# EAGLE design munia-n64 (EAGLE 9.1.0)

## Sheet 1 of 4: MCU
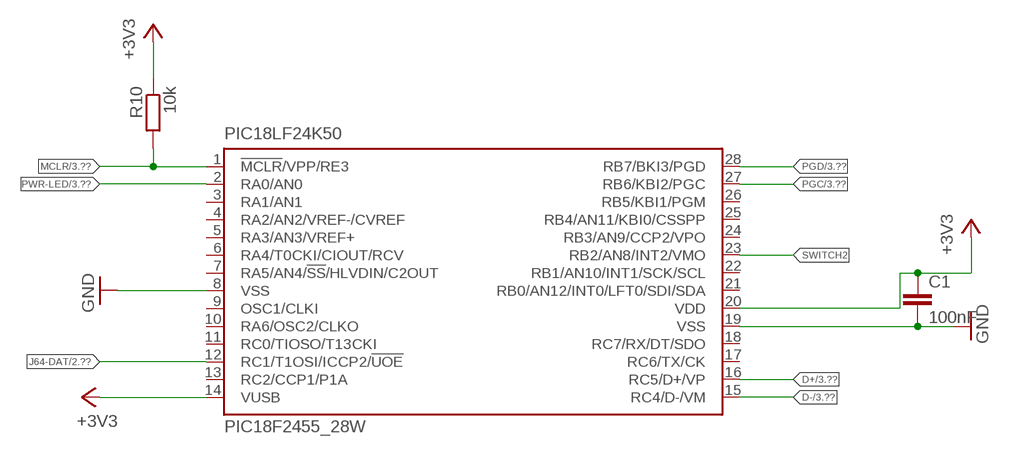
[diagram p0: schematic, sheet 1]

### Parts
C1  100nF  C-EUC0603  [C0603]
PIC18LF24K50  PIC18F2455_28W  [SO28W]
R10  10k  R-EU_R0603  [R0603]

### Nets
+3V3: C1.1 PIC18LF24K50.14(VUSB) PIC18LF24K50.20(VDD) R10.1 ; also sheet 2,3,4
D+: PIC18LF24K50.16(RC5/D+/VP) ; also sheet 3
D-: PIC18LF24K50.15(RC4/D-/VM) ; also sheet 3
GND: C1.2 PIC18LF24K50.8(VSS) PIC18LF24K50.19(VSS) ; also sheet 2,3,4
J64-DAT: PIC18LF24K50.12(RC1/T1OSI/ICCP2/!UOE) ; also sheet 2,3
MCLR: PIC18LF24K50.1(!MCLR!/VPP/RE3) R10.2 ; also sheet 3
PGC: PIC18LF24K50.27(RB6/KBI2/PGC) ; also sheet 3
PGD: PIC18LF24K50.28(RB7/BKI3/PGD) ; also sheet 3
PWR-LED: PIC18LF24K50.2(RA0/AN0) ; also sheet 3
SWITCH2: PIC18LF24K50.23(RB2/AN8/INT2/VMO)
Unconnected: PIC18LF24K50.3(RA1/AN1) PIC18LF24K50.4(RA2/AN2/VREF-/CVREF) PIC18LF24K50.5(RA3/AN3/VREF+) PIC18LF24K50.6(RA4/T0CKI/CIOUT/RCV) PIC18LF24K50.7(RA5/AN4/!SS!/HLVDIN/C2OUT) PIC18LF24K50.9(OSC1/CLKI) PIC18LF24K50.10(RA6/OSC2/CLKO) PIC18LF24K50.11(RC0/TIOSO/T13CKI) PIC18LF24K50.13(RC2/CCP1/P1A) PIC18LF24K50.17(RC6/TX/CK) PIC18LF24K50.18(RC7/RX/DT/SDO) PIC18LF24K50.21(RB0/AN12/INT0/LFT0/SDI/SDA) PIC18LF24K50.22(RB1/AN10/INT1/SCK/SCL) PIC18LF24K50.24(RB3/AN9/CCP2/VPO) PIC18LF24K50.25(RB4/AN11/KBI0/CSSPP) PIC18LF24K50.26(RB5/KBI1/PGM)

## Sheet 2 of 4: SIGNALS
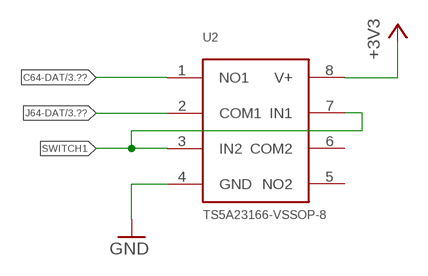
[diagram p1: schematic, sheet 2]

### Parts
U2  TS5A23166-VSSOP-8  [SOT765]

### Nets
+3V3: U2.8(V+) ; also sheet 1,3,4
C64-DAT: U2.1(NO1) ; also sheet 3
GND: U2.4(GND) ; also sheet 1,3,4
J64-DAT: U2.2(COM1) ; also sheet 1,3
SWITCH1: U2.3(IN2) U2.7(IN1)
Unconnected: U2.5(NO2) U2.6(COM2)

## Sheet 3 of 4: CONNECTORS
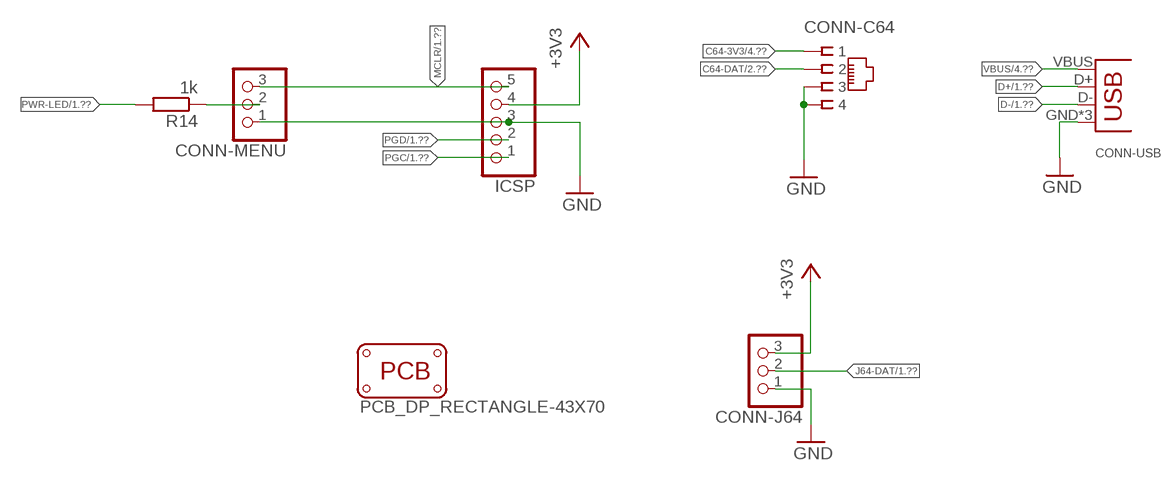
[diagram p2: schematic, sheet 3]

### Parts
CONN-C64  RJ11-6P4C  [RJ11-4C]
CONN-J64  PINHD-1X3  [1X03]
CONN-MENU  PINHD-1X3  [1X03]
CONN-USB  USB-B-NIELS  [USB-B-H]
ICSP  PINHD-1X5  [1X05]
PCB1  PCB_DP_RECTANGLE-43X70  [DP7043_V1]
R14  1k  R-EU_R0603  [R0603]

### Nets
+3V3: CONN-J64.3 ICSP.4 ; also sheet 1,2,4
C64-3V3: CONN-C64.1 ; also sheet 4
C64-DAT: CONN-C64.2 ; also sheet 2
D+: CONN-USB.D+ ; also sheet 1
D-: CONN-USB.D- ; also sheet 1
GND: CONN-C64.3 CONN-C64.4 CONN-J64.1 CONN-MENU.1 CONN-USB.GND CONN-USB.GND@1(GND) CONN-USB.GND@2(GND) ICSP.3 ; also sheet 1,2,4
J64-DAT: CONN-J64.2 ; also sheet 1,2
MCLR: CONN-MENU.3 ICSP.5 ; also sheet 1
N$1: CONN-MENU.2 R14.1
PGC: ICSP.1 ; also sheet 1
PGD: ICSP.2 ; also sheet 1
PWR-LED: R14.2 ; also sheet 1
VBUS: CONN-USB.VBUS ; also sheet 4

## Sheet 4 of 4: POWER
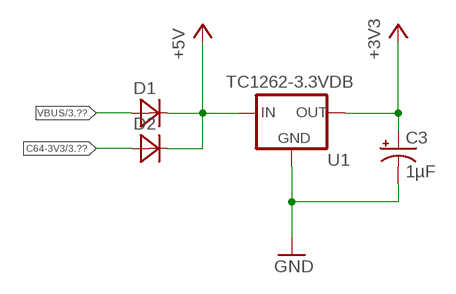
[diagram p3: schematic, sheet 4]

### Parts
C3  1µF  TANT-CAP1206  [EIA3216]
D1  MBR120VLSFT1G  [SOD123]
D2  MBR120VLSFT1G  [SOD123]
U1  TC1262-3.3VDB  [SOT230P700X180-4N]

### Nets
+3V3: C3.A(+) U1.3(OUT) ; also sheet 1,2,3
+5V: D1.1(C) D2.1(C) U1.1(IN)
C64-3V3: D2.2(A) ; also sheet 3
GND: C3.C(-) U1.2(GND) U1.4(GND) ; also sheet 1,2,3
VBUS: D1.2(A) ; also sheet 3

## Library data of the parts
C1 = resistor:C-EU: CAPACITOR, European symbol
C3 = Spark:TANT-CAP: Tantalum SMT
CONN-C64 = frank:RJ11-6P4C
CONN-J64 CONN-MENU = pinhead:PINHD-1X3: PIN HEADER
CONN-USB = frank:USB: USB Connectors
D1 D2 = frank:MBR120VLSFT1G: DIODE, SCHOTTKY, 1A, 20V, SOD-123FL
ICSP = pinhead:PINHD-1X5: PIN HEADER
PCB1 = dp_pcb:PCB_DP_RECTANGLE: Dangerous Prototypes Standard Rectangular PCB sizes
PIC18LF24K50 = microchip:PIC18F2*_28: USB Microcontrollers with nanoWatt Technology High-Performance, Enhanced Flash, 28/40/44-Pin, Source: http://ww1.microchip.com/downloads/en/devicedoc/39632c.pdf; MF: MICROCHIP; MPN: PIC18F2455-I/SO; OC_FARNELL: 1579598; OC_NEWARK: 64J3768
R10 R14 = resistor:R-EU_: RESISTOR, European symbol
U1 = frank:TC1262-3.3VDB: IC, 500mA Fixed Output CMOS LDO,3.3V,SOT-223, 3-lead; MPN: TC1262-3.3VDB; OC_FARNELL: 1852183; OC_NEWARK: 53R0370; PACKAGE: SOT-223-3; SUPPLIER: Microchip
U2 = frank:TS5A23166

## Net classes
0 default: width 0.152 mm, drill 0.25 mm, clearance 0.152 mm

## Board
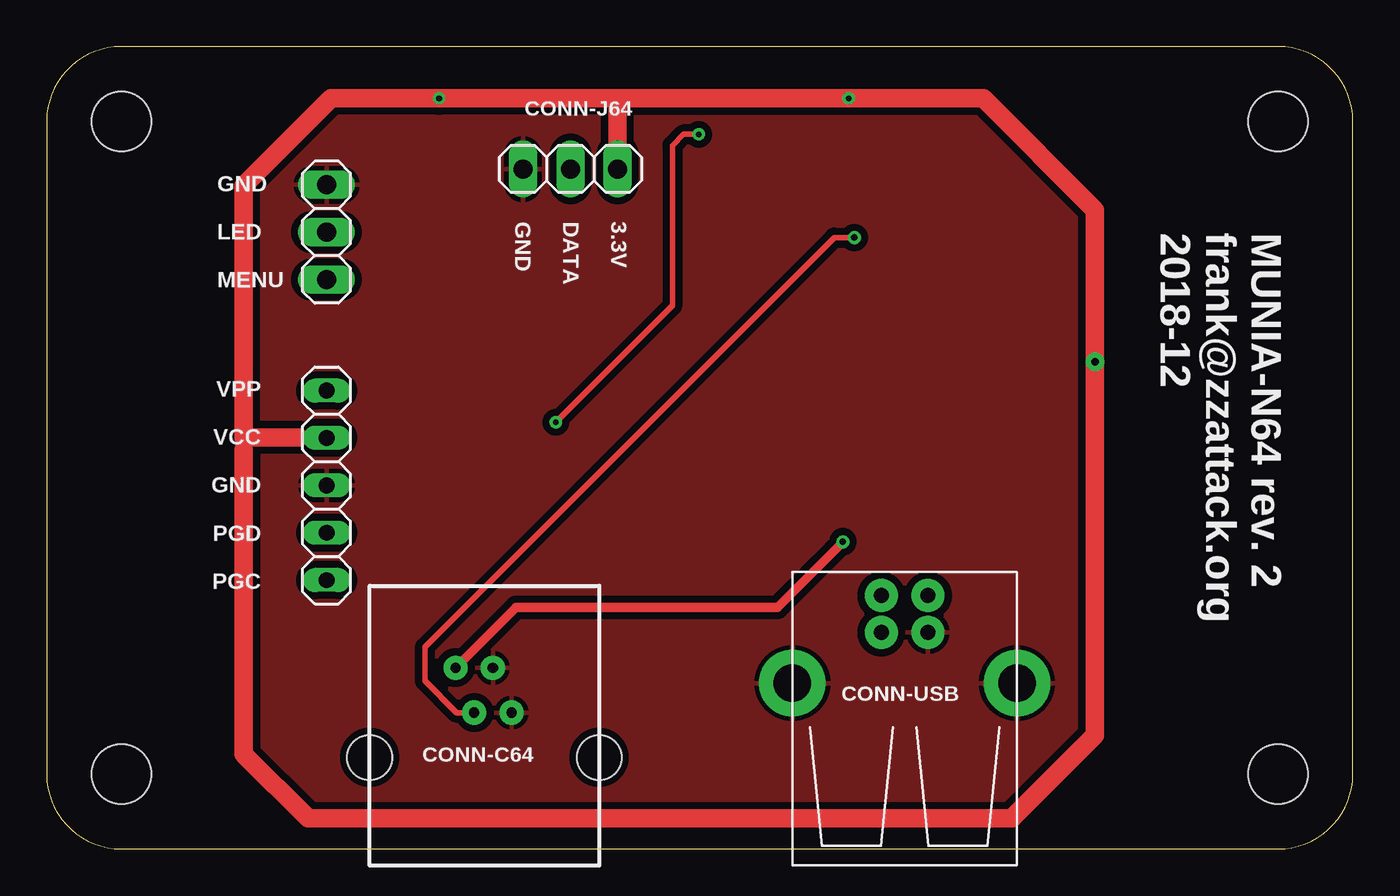
[diagram p4: board, top side]
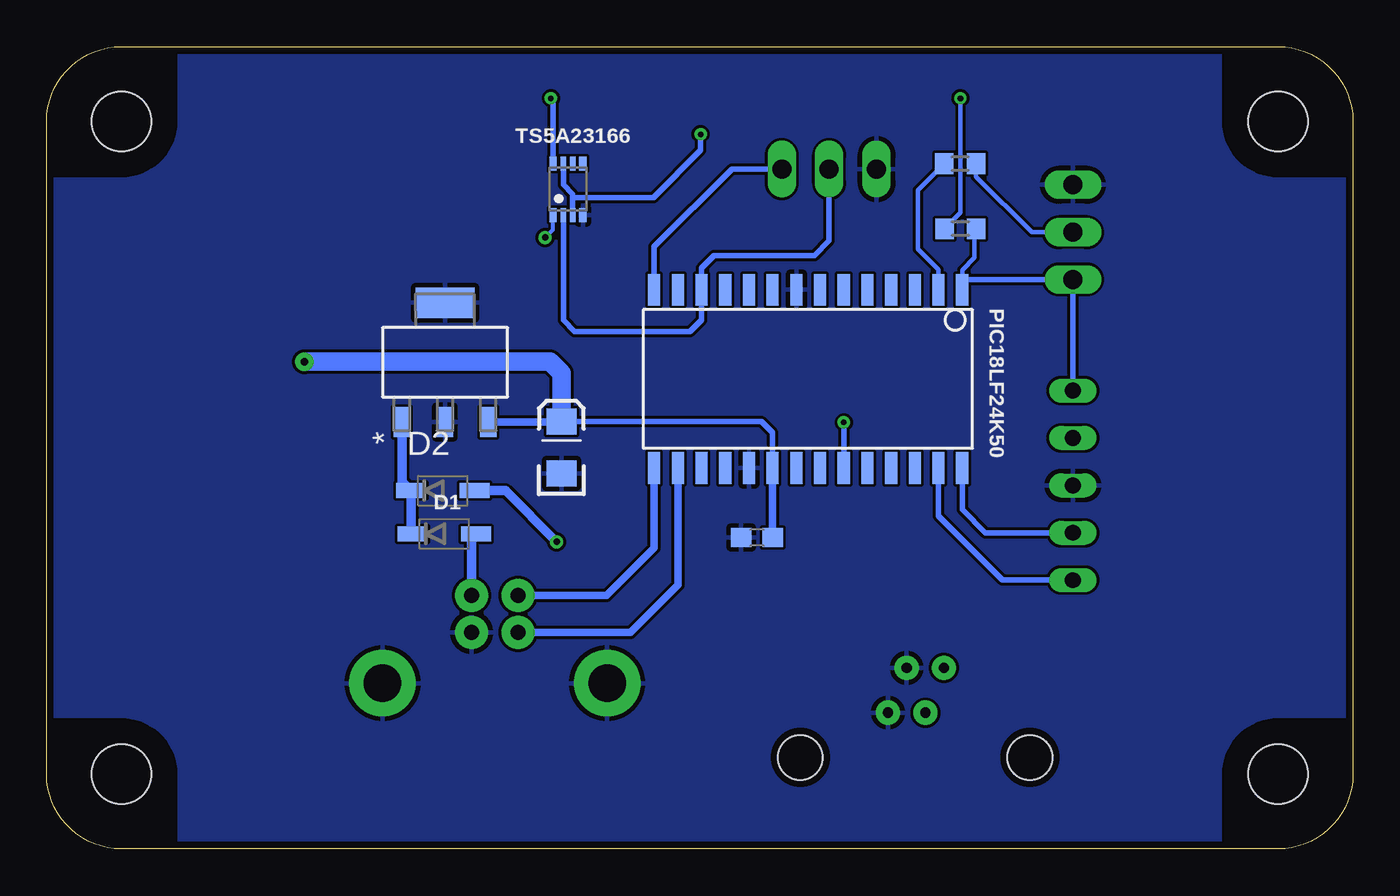
[diagram p5: board, bottom side, seen from below]

Size 70 x 43 mm. Coordinates in mm from the lower left corner, seen from the top.
Copper layers (1*16): Top 0.0356mm / dielectric 1.5011mm / Bottom 0.0356mm
Design rules "pcbway 6mil 0.3mm drills *": minimum track width 6mil, minimum drill 0.3mm, track to track 6mil, track to pad 6mil, pad to pad 6mil, via to via 6mil, smd to smd 6mil, copper to edge 15mil, drill to drill 6mil, minimum pad ring 7mil, minimum via ring 7mil, stop-mask expansion 4mil, vias tented up to drill 999mil, thermal gap 10mil

### Footprints (pad centres in the part's own frame; a part is rotated, then mirrored left to right if it is on the bottom)
C0603 = smd 1.1 x 1: 1 -0.85,0; 2 0.85,0
EIA3216 = smd 1.4 x 1.6: A 1.4,0; C -1.4,0
RJ11-4C = drill 0.55 pad 1.3: 1 4.6,10.6; 2 5.6,8.2; 3 6.6,10.6; 4 7.6,8.2 | hole 2.4: 0,5.8; 12.3,5.8
1X03 = drill 1.016 long: 1 -2.54,0; 2 0,0; 3 2.54,0
USB-B-H = drill 0.8 pad 1.778: D+ 0,1.25; D- 1.981,1.25; GND 0,-1.25; VBUS 1.981,-1.25 | drill 2 pad 3.556: GND@1 -2.718,-6.02; GND@2 -2.718,6.02
SOD123 = smd 1.6 x 0.8: 1 -1.7,0; 2 1.7,0
1X05 = drill 0.85 long: 1 -5.08,0; 2 -2.54,0; 3 0,0; 4 2.54,0; 5 5.08,0
DP7043_V1 = hole 3.2: 4,4; 66,4; 66,39; 4,39
SO28W = smd 0.65 x 1.7: 1 -7.62,-4.78; 2 -6.35,-4.78; 3 -5.08,-4.78; 4 -3.81,-4.78; 5 -2.54,-4.78; 6 -1.27,-4.78; 7 0,-4.78; 8 1.27,-4.78; 9 2.54,-4.78; 10 3.81,-4.78; 11 5.08,-4.78; 12 6.35,-4.78; 13 7.62,-4.78; 14 8.89,-4.78; 15 8.89,4.78; 16 7.62,4.78; 17 6.35,4.78; 18 5.08,4.78; 19 3.81,4.78; 20 2.54,4.78; 21 1.27,4.78; 22 0,4.78; 23 -1.27,4.78; 24 -2.54,4.78; 25 -3.81,4.78; 26 -5.08,4.78; 27 -6.35,4.78; 28 -7.62,4.78
R0603 = smd 1 x 1.1: 1 -0.85,0; 2 0.85,0
SOT230P700X180-4N = smd 1.626 x 0.889: 1 -3.2,2.311; 2 -3.2,0; 3 -3.2,-2.311 | smd 1.626 x 3.175: 4 3.2,0
SOT765 = smd 0.4 x 0.75: 1 -0.8,-1.375; 4 0.8,-1.375; 5 0.8,1.375; 8 -0.8,1.375 | smd 0.3 x 0.75: 2 -0.25,-1.375; 3 0.25,-1.375; 6 0.25,1.375; 7 -0.25,1.375

### Placement (x,y rotation side)
C1  31.94,16.69 180 bottom
C3  42.42,21.51 90 bottom
CONN-C64  17.31,-0.9 0 top
CONN-J64  28.06,36.44 0 top
CONN-MENU  15,33.06 270 top
CONN-USB  45.98,11.6 90 top
D1  48.69,16.89 0 bottom
D2  48.77,19.2 0 bottom
ICSP  15,19.49 90 top
PCB1  0,0 0 top
PIC18LF24K50  28.55,25.19 180 bottom
R10  21.03,33.24 0 bottom
R14  21.04,36.73 180 bottom
U1  48.65,26.08 90 bottom
U2  42.06,35.36 0 bottom

### Tracks (layer width: path | path; a pad name or v marks a point on that pad's centre or on a via)
+3V3  (via drill 0.3, 0.4 pad 1)
  Top 0.406: 10.57,22.06 10.57,21.54 | ICSP.4 13.53,22.06
  Top 1: 10.57,21.42 10.57,5.08 14.02,1.63 51.71,1.63 56.19,6.1 v56.19,26.11 56.19,34.24 50.19,40.23 v42.98,40.23 30.33,40.23 | 30.33,40.23 v21.03,40.23 15.24,40.23 10.57,35.56 10.57,22.06 13.53,22.06 | CONN-J64.3 30.61,39.95 30.33,40.23
  Bottom 0.254: R10.1 21.03,34.09 v21.03,40.23
  Bottom 0.305: PIC18LF24K50.20 31.09,22.3 31.7,22.91 C3.A | PIC18LF24K50.14 37.44,32.27 33.27,36.45 CONN-J64.3 | U2.8 42.86,40.12 v42.98,40.23
  Bottom 0.406: C3.A 42.45,22.88 U1.3 | C1.1 31.09,16.7 PIC18LF24K50.20 | CONN-J64.3 30.61,36.44
  Bottom 1: C3.A 42.41,25.5 43.02,26.11 v56.19,26.11
+5V
  Bottom 0.508: D1.1 50.47,16.97 D2.1 50.96,19.7 U1.1
C64-3V3  (via drill 0.35)
  Top 0.508: v42.67,16.46 39.17,12.95 25.16,12.95 CONN-C64.1
  Bottom 0.508: D2.2 45.41,19.2 v42.67,16.46
C64-DAT  (via drill 0.35)
  Top 0.305: CONN-C64.2 21.96,7.3 20.27,8.99 20.27,10.82 42.22,32.77 v43.28,32.77
  Bottom 0.152: U2.1
  Bottom 0.203: v43.28,32.77 42.87,33.18 U2.1
D+
  Bottom 0.406: PIC18LF24K50.16 36.17,14.14 38.71,11.6 CONN-USB.D+
D-
  Bottom 0.406: PIC18LF24K50.15 37.44,16.12 39.98,13.58 CONN-USB.D-
GND
  pour Top (isolate 0.381): 0,0 0,43 70,43 70,0
  pour Bottom: 0,0 70,0 70,43 0,43
J64-DAT
  Bottom 0.305: CONN-J64.2 28.07,32.59 28.85,31.8 34.24,31.8 34.9,31.14 PIC18LF24K50.12 34.9,28.34 35.51,27.74 41.7,27.74 42.31,28.35 U2.2
MCLR
  Bottom 0.254: 20.18,30.53 20.2,30.5 | PIC18LF24K50.1 20.93,31.03 20.27,31.7 20.27,33.16 R10.2
  Bottom 0.305: ICSP.5 CONN-MENU.3 | PIC18LF24K50.1 20.93,30.5 20.2,30.5 15.01,30.5 CONN-MENU.3 | CONN-MENU.3 15.02,30.53
N$1
  Bottom 0.254: CONN-MENU.2 17.21,33.06 20.19,36.04 R14.1
PGC
  Bottom 0.305: PIC18LF24K50.27 22.2,17.84 18.77,14.4 ICSP.1
PGD
  Bottom 0.305: PIC18LF24K50.28 20.93,18.19 19.69,16.95 ICSP.2
PWR-LED
  Bottom 0.254: R14.2 23.32,35.3 23.32,32.16 22.2,31.04 PIC18LF24K50.2
SWITCH1  (via drill 0.3)
  Top 0.305: v34.95,38.3 34.14,38.3 33.53,37.69 33.53,29.11 v27.28,22.86
  Bottom 0.305: v27.28,22.86 27.28,20.41 | U2.3 41.81,34.9 | U2.7 42.31,35.61 41.81,35.11 41.81,34.9 | 41.81,34.9 37.49,34.9 34.95,37.44 v34.95,38.3
VBUS
  Bottom 0.508: CONN-USB.VBUS 47.23,16.65 D1.2

### Text on the board
tNames: 3.3V / / DATA / / GND | MUNIA-N64 rev. 2 / frank@zzattack.org / 2018-12 | GND / / LED / / MENU | VPP / / VCC / / GND / / PGD / / PGC
bNames: TS5A23166